# Altium schematic sheet REG.SchDoc
size A; SheetNumber: 2; SheetTotal: 2
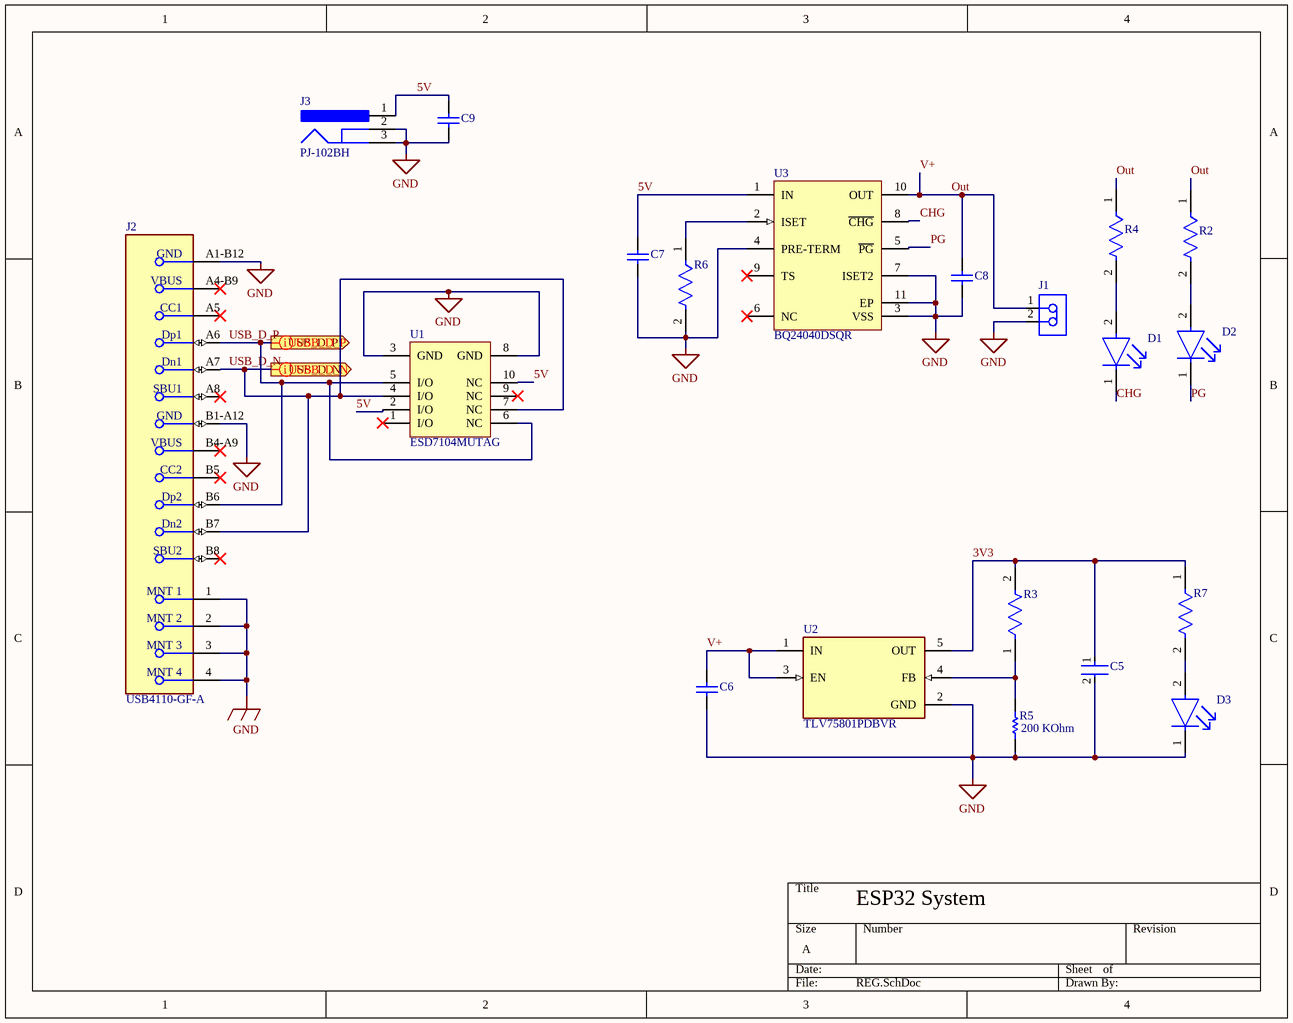
[diagram p0: REG.SchDoc]

## Parts
C5  GRM188Z71A106KA73J  [FP-GRM188-0_2-IPC_B]  (value not drawn)
C6  C0603C105K4RACTU  [CAPC1608X90X35LL15T15]  (value not drawn)
C7  C0603C105K4RACTU  [CAPC1608X90X35LL15T15]  (value not drawn)
C8  C0603C105K4RACTU  [CAPC1608X90X35LL15T15]  (value not drawn)
C9  C0603C105K4RACTU  [CAPC1608X90X35LL15T15]  (value not drawn)
D1  LTST-C230EKT  [FP-LTST-C230EKT-MFG]  (value not drawn)
D2  APT1608ZGCK  [FP-APT1608ZGCK-MFG]  (value not drawn)
D3  APT1608ZGCK  [FP-APT1608ZGCK-MFG]  (value not drawn)
J1  B2B-PH-K-S(LF)(SN)  [JST-B2B-PH-K-S_V]  (value not drawn)
J2  USB4110-GF-A  [FP-USB4110-GF-A-MFG]
J3  PJ-102BH  [CUI-PJ-102BH_V]
R2  RN73R1JTTD1501B25  [FP-RN73R1J-IPC_A]  (value not drawn)
R3  AT0603BRD0740KL  [FP-AT0603-IPC_B]  (value not drawn)
R4  RN73R1JTTD1501B25  [FP-RN73R1J-IPC_A]  (value not drawn)
R5  Resistance: 200 KOhm  [RESC1005X40X25NL05T05]  (hidden comment: ERJ-2RKF2003X)
R6  CRGCQ0402J1K0  [FP-CRGCQ0402-IPC_C]  (value not drawn)
R7  TFCR0402-16W-E-1001DT  [FP-TFCR0402-IPC_A]  (value not drawn)
U1  ESD7104MUTAG  [ONSC-UDFN-10-517BB-01_V]
U2  TLV75801PDBVR  [FP-DBV0005A-IPC_C]
U3  BQ24040DSQR  [DSQ0010A_V]

## Ports
USB_D_N (out, see ESP32-S3[2C]), USB_D_P (out, see ESP32-S3[2C])

## Nets
GND: C5.2 C6.1 C7.1 C8.1 C9.1 D3.1(C) J1.2 J2.1(MNT_1) J2.2(MNT_2) J2.3(MNT_3) J2.4(MNT_4) J2.A1-B12(GND) J2.B1-A12(GND) J3.2 J3.3 R5.1 R6.2 U1.3(GND) U1.8(GND) U2.2(GND) U3.3(VSS) U3.4(PRE-TERM) U3.7(ISET2) U3.11(EP)
3V3: C5.1 R3.2 R7.1 U2.5(OUT)
5V: C7.2 C9.2 J3.1 U1.2(I/O) U1.10(NC) U3.1(IN)
CHG: D1.1(C) U3.8(~{CHG})
Out: C6.2 C8.2 J1.1 R2.1 R4.1 U2.1(IN) U2.3(EN) U3.10(OUT)  [also labelled V+]
PG: D2.1(C) U3.5(~{PG})
USB_D_N: J2.A7(Dn1) J2.B7(Dn2) U1.4(I/O) U1.7(NC) ; port USB_D_N
USB_D_P: J2.A6(Dp1) J2.B6(Dp2) U1.5(I/O) U1.6(NC) ; port USB_D_P
NetD1_2: D1.2(A) R4.2
NetD2_2: D2.2(A) R2.2
NetD3_2: D3.2(A) R7.2
NetR3_1: R3.1 R5.2 U2.4(FB)
NetR6_1: R6.1 U3.2(ISET)

Not connected (* = marked no-connect by the designer): J2 A4-B9(VBUS)* A5(CC1)* A8(SBU1)* B4-A9(VBUS)* B5(CC2)* B8(SBU2)*; U1 1(I/O)* 9(NC)*; U3 6(NC)* 9(TS)*

## Layout directives
differential pair: USB_D_N, USB_D_P

## Notes on the sheet
- ESP32 System

## Library data of the parts
C5 = CMP-06035-020296-1: Chip Multilayer Ceramic Capacitors for General Purpose, 0603, 10uF, X7R, 15%, 10%, 10V
C6-C9 = CMP-2006-02298-2: Manufacturer: Kemet; Part Number: C0603C105K4RACTU
D1 = CMP-22017-000030-1: LED RED CLEAR CHIP SMD; Forward Current: 30mA; Test Current: 10mA; Number of Elements: 1; Viewing Angle: 130°; Dominant Wavelength: 621nm; Forward Voltage: 2V; Lens Style: Diffused; Power Rating: 100mW; Reverse Voltage: 5V; Wavelength: 630nm; Luminous Intensity: 6mcd; Lens Color: Colorless; Case/Package: 1206; Case Code (Imperial): 1206; Package Quantity: 1; Lead Free: Lead Free; Case Code (Metric): 3216; Height: 1.1mm; Lens Transparency: Clear; Mount: Surface Mount; Depth: 1.6mm; Number of LEDs: 1; Power Dissipation: 100mW; Max Operating Temperature: 85°C; Width: 1.6mm; Color: Red; Number of Pins: 2; Min Operating Temperature: -55°C; Packaging: Tape and Reel; Radiation Hardening: No; Illumination Color: Red; Length: 3.2mm
D2 D3 = CMP-44529-000024-1: LED GREEN CLEAR CHIP SMD; Forward Voltage: 3.3V; Dominant Wavelength: 525nm; Forward Current: 20mA; Lens Color: Colorless; Viewing Angle: 120°; Luminous Intensity: 350mcd; Lens Transparency: Clear; Color: Green; Max Operating Temperature: 85°C; Case/Package: 0603; Mount: Surface Mount; Min Operating Temperature: -40°C; Case Code (Metric): 1608; Test Current: 20mA; Packaging: Tape and Reel; Width: 0.8mm; Package Quantity: 1; Height: 0.75mm; Length: 1.6mm; Illumination Color: Green; Lead Free: Lead Free; Case Code (Imperial): 0603
J1 = CMP-2000-05162-1: Male Header, Pitch 2 mm, 1 x 2 Position, Height 6 mm, Tail Length 3.4 mm, -25 to 85 degC, RoHS, Bulk; Manufacturer: JST; Pitch: 2mm; Style/Orientation: StraightHeader/Plug; No of Positions: 2; Datasheet Version: Nov-08; Datasheet URL: http://datasheet.octopart.com/B2B-PH-K-S%28LF%29%28SN%29-JST-datasheet-8324864.pdf; Manufacturer URL: http://www.jst.com/home2.html; Type: ShroudedHeader; Termination: Crimp
J2 = CMP-245163-000002-1: CONN USB 2.0 TYPE-C R/A SMT; Manufacturer: GCT; Conn Orientation: Right Angle; Usb Standard: USB 2.0; Voltage Rating: 20V; Current Rating: 3/4.25/1.25/0.25A; Number Of Contacts: 16; Is Female: yes; Shielding: true; Standoff Height: 0.1mm; Octopart: https://octopart.com/usb4110-gf-a-gct-103941985; Temperature: -40°C to +85°C; RoHS: TRUE; Automotive: No; Contact Material: Gold,Nickel; Device Class L1: Connectors; Device Class L2: USB Connectors; Package: 0; Lead Free: Yes; ComponentLink2URL: https://gct.co/files/drawings/usb4110.pdf; Temperature Range High: +85°C; Temperature Range Low: -40°C; Height: 3.46mm; Manufacturer Part Number: USB4110-GF-A; ComponentLink2Description: Datasheet; Device Class L3: unset; Digikey Description: CONN USB 2.0 TYPE-C R/A SMT; Category: Conn
J3 = CMP-2000-06901-1: Through Hole Right Angle DC Power Jack, 5 A, 2.5 mm Center Pin, 3 Position, -25 to 85 degC, RoHS, Bulk; Manufacturer: CUIInc.; Outside Contact Diameter: 6.5mm; Current Rating: 5A; Brand: CUI; Insulation Resistance: 100MOhms; Inside Contact Diameter: 2.5mm; Voltage Rating: 24V; Operating Temperature Range: -25Cto+85C; Mounting Angle: Right; Mounting Technology: ThroughHole; Product Category: DCPowerConnectors; Datasheet Version: Rev. 1.02, 05/2016; Connector Type: DCPowerJack; Contact Material: Copper; Housing Material: PolybutyleneTerephthalate(PBT); Mounting Style: ThroughHole; Product: Jacks; Package Reference: PJ-102BH; Manufacturer URL: http://www.cui.com/; RoHS: True; Contact Gender: Male; Contact Plating: Nickel; Flammability Rating: UL94V-0; Factory Pack Quantity: 280; Datasheet URL: http://www.cui.com/product/resource/pj-102bh.pdf; Package Description: 3-Pin Through Hole Device, Body 14.4 x 9 mm, Height 11 mm; Termination Style: ThroughHole
R2 R4 = CMP-04015-030520-1: 1.5kΩ ±0.1% 0.1W, 1/10W Chip Resistor 0603 (1608 Metric) Moisture Resistant Thin Film
R3 = CMP-03412-038922-1: Thin Film Chip Resistors Automotive Grade 40kΩ 0.1% 25ppm/°C 0603
R5 = CMP-1011-00768-4: Chip Resistor, 200 KOhm, +/- 1%, 100 mW, -55 to 155 degC, 0402 (1005 Metric), RoHS, Tape and Reel; Manufacturer: Basic Passives; Case\/Package: 0402; Voltage Rating: 50 V; Power Rating: 100 mW; RoHSCompliant: true; Length: 1 mm; DatasheetVersion: 04/2015; ComponentLink2URL: http://industrial.panasonic.com/cdbs/www-data/pdf/RDA0000/AOA0000C86.pdf; Mount: Surface Mount; PackageDescription: 2-Pin Surface Mount Device, Body 1 x 0.5 mm; PartNumber: ERJ-2RKF2003X; Tolerance: 1%; Width: 0.5 mm; ComponentLink2Description: Datasheet; Packaging: Tape and Reel; REACH SVHC: No SVHC; Min Operating Temperature: -55 degC; Package Quantity: 10000; ComponentLink1Description: Manufacturer URL; Height: 0.35 mm; ComponentLink1URL: http://www.panasonic.com/; Mounting Technology: Surface Mount; Case Code (Imperial): 0402; PackageReference: 0402; Radiation Hardening: No; Pins: 2; Max Operating Temperature: 155 degC; Case Code (Metric): 1005
R6 = CMP-03211-005510-1: CRGCQ 0402 1K0 5%; Manufacturer: TE Connectivity; Power Rating: 0.0625W; Tolerance: 0.05; Voltage Rating: 50V; Value: 1KΩ; Temperature Coefficient: ±100ppm/°C; Temperature: -55°C to +155°C; Device Class L3: Chip SMD Resistors; Lead Free: Yes; Temperature Range High: +155°C; RoHS: TRUE; Manufacturer Part Number: CRGCQ0402J1K0; Automotive: Yes; Ambient Temperature Range High: +70°C; Series: CRGCQ; ComponentLink2URL: https://www.te.com/commerce/DocumentDelivery/DDEController?Action=showdoc&DocId=Data+Sheet%7F1773204-3%7F1%7Fpdf%7FEnglish%7FENG_DS_1773204-3_1.pdf%7F4-2176347-695; Digikey Description: CRGCQ 0402 1K0 5%; ComponentLink2Description: Datasheet; Device Class L2: Resistors; Composition: Thick Film; Device Class L1: Passive Components; Package: CRGCQ0402; Resistance: 1KΩ; Temperature Range Low: -55°C; Height: 0.4mm; Category: Res; Ipc Land Pattern Name: RESC10050X35; Octopart: https://octopart.com/crgcq0402j1k0-te+connectivity-91018000
R7 = CMP-250906-247784-1: RES Thin Film,  1kΩ, 0.5%, 0.063W, 25ppm/°C, 0402
U1 = CMP-1063-00242-1: Transient Voltage Suppressor, Low Capacitance ESD Protection for High Speed Data, 10-Pin UDFN, Pb-Free, Tape and Reel; Manufacturer: On Semiconductor; IR Max (uA): 1; Number of Lines: 4; VRWM Max (V): 5; Direction: Bidirectional; V(BR) Min (V): 5.5; PackageDescription: 10-Pin Small Outline No-Lead, Body 2.5 x 1 mm, Pitch 0.5 mm; ComponentLink3URL: http://www.onsemi.com/pub_link/Collateral/517BB.PDF; PackageReference: UDFN-10-517BB-01; Mounting Technology: Surface Mount; PartNumber: ESD7104MUTAG; ComponentLink1URL: http://www.onsemi.com/; ComponentLink1Description: Manufacturer URL; DatasheetVersion: Rev. 2; ComponentLink2Description: Datasheet; ComponentLink2URL: http://www.onsemi.cn/pub_link/Collateral/ESD7104-D.PDF; PackageVersion: Rev. O, 11/2009; Packing: Tape and Reel; RoHS: Pb-Free; ComponentLink3Description: Package Specification
U2 = CMP-04917-000142-1: IC POWER MANAGEMENT SUPERVISORY
U3 = CMP-0321-00456-2: 800 mA, Single-Input, Single Cell Li-Ion Battery Charger with Auto Start. Vovp=6.6 V, 3.5 V, -40 to 85 degC, 10-pin SON (DSQ), Green (RoHS & no Sb/Br); Manufacturer: Texas Instruments; NiCd: N; Vin(Min)(V): 3.5; SubFamily: Battery Charge Management; PackageDescription: 10-Pin Plastic Small Outline No-Lead, 2 x 2 x 0.8 mm Body, 0.4 mm Pitch, Exposed Pad; PackageVersion: revB, Apr-2010; Mounting Technology: Surface Mount; Eco-Plan: Green (RoHS & no Sb/Br); ComponentLink1URL: http://www.ti.com/general/docs/lit/getliterature.tsp?genericPartNumber=BQ24040&fileType=pdf; PartNumber: BQ24040DSQR; DatasheetVersion: SLUS941A; Over Voltage Protection: N; PackageReference: DSQ0010A; NiMH: N; Li-Ion: N; Lead Acid: N; Li-Polymer: N; ComponentLink1Description: Datasheet